# EAGLE schematic CntrlBoardV3B (EAGLE 8.3.2)

## Sheet 1 of 8: µC, MRAM, I2C Memory, and Peripherals
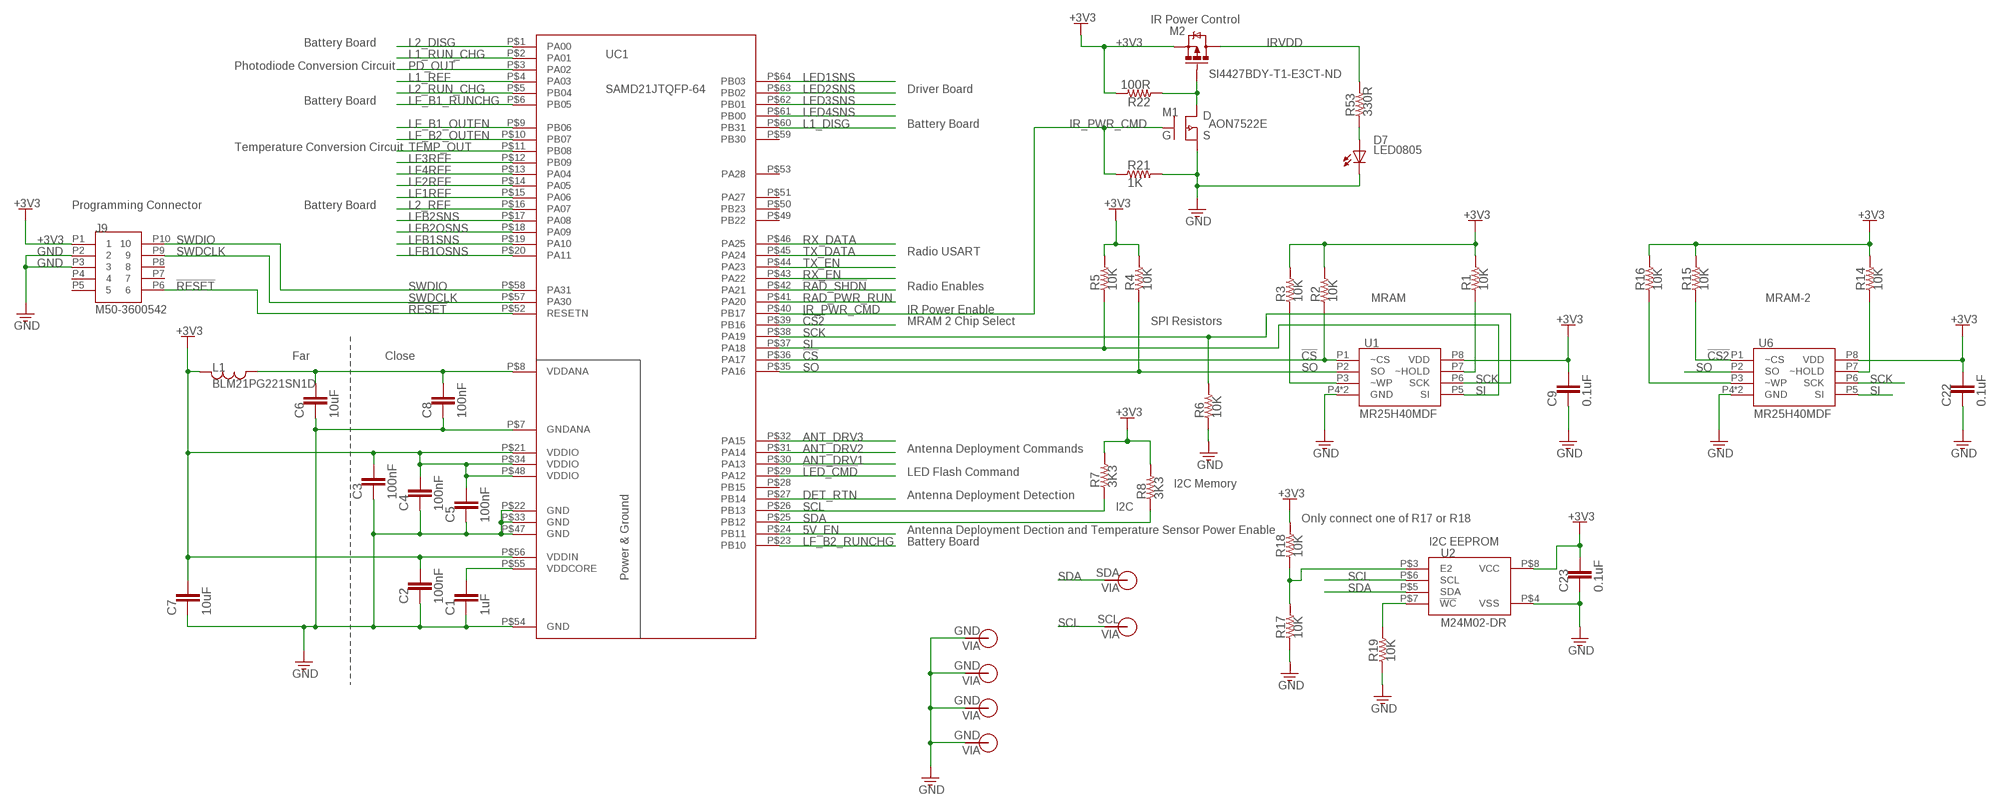
[diagram p0: schematic, sheet 1]

### Parts
C1  1uF  CAP0805  [0805]
C2  100nF  CAP0805  [0805]
C3  100nF  CAP0805  [0805]
C4  100nF  CAP0805  [0805]
C5  100nF  CAP0805  [0805]
C6  10uF  CAP0805  [0805]
C7  10uF  CAP0805  [0805]
C8  100nF  CAP0805  [0805]
C9  0.1uF  CAP0805  [0805]
C22  0.1uF  CAP0805  [0805]
C23  0.1uF  CAP0805  [0805]
D7  LED0805  [0805-D]
J9  M50-3600542  10PINMALE  [10PINMALE]
L1  BLM21PG221SN1D  FERRITE  [0805]
M1  AON7522E  [DFN-3X3-8]
M2  SI4427BDY-T1-E3CT-ND  POWERPMOS  [SO08]
R1  10K  RES0805  [0805]
R2  10K  RES0805  [0805]
R3  10K  RES0805  [0805]
R4  10K  RES0805  [0805]
R5  10K  RES0805  [0805]
R6  10K  RES0805  [0805]
R7  3K3  RES0805  [0805]
R8  3K3  RES0805  [0805]
R14  10K  RES0805  [0805]
R15  10K  RES0805  [0805]
R16  10K  RES0805  [0805]
R17  10K  RES0805  [0805]
R18  10K  RES0805  [0805]
R19  10K  RES0805  [0805]
R21  1K  RES0805  [0805]
R22  100R  RES0805  [0805]
R53  330R  RES0805  [0805]
U1  MR25H40MDF  MR2XHXX  [8PXMO-229]
U2  M24M02-DR  [SO-8]
U6  MR25H40MDF  MR2XHXX  [8PXMO-229]
UC1  SAMD21JTQFP-64  [TQFP-64]
V4  SDA  VIA60MIL-SQ  [VIA-60MIL-SQ]
V5  SCL  VIA60MIL-SQ  [VIA-60MIL-SQ]
V9  GND  VIA60MIL-SQ  [VIA-60MIL-SQ]
V10  GND  VIA60MIL-SQ  [VIA-60MIL-SQ]
V11  GND  VIA60MIL-SQ  [VIA-60MIL-SQ]
V12  GND  VIA60MIL-SQ  [VIA-60MIL-SQ]

### Nets
5V_EN: UC1.P$24(PB11) ; also sheet 2
!CS2!: R15.1 U6.P1(~CS) UC1.P$39(PB16)
!CS!: R2.1 U1.P1(~CS) UC1.P$36(PA17)
!LED_CMD!: UC1.P$29(PA12) ; also sheet 7
!RAD_SHDN!: UC1.P$42(PA21) ; also sheet 3
!RESET!: J9.P6 UC1.P$52(RESETN) ; also sheet 6
+3V3: C2.1 C3.1 C4.1 C5.1 C7.1 C9.1 C22.1 C23.1 J9.P1 L1.1 M2.1(S) M2.2(S) M2.3(S) R1.2 R2.2 R3.2 R4.2 R5.2 R7.2 R8.2 R14.2 R15.2 R16.2 R18.2 R22.2 U1.P8(VDD) U2.P$8(VCC) U6.P8(VDD) UC1.P$21(VDDIO) UC1.P$34(VDDIO) UC1.P$48(VDDIO) UC1.P$56(VDDIN) ; also sheet 2,3,4,5,6,7,8
ANT_DRV1: UC1.P$30(PA13) ; also sheet 7
ANT_DRV2: UC1.P$31(PA14) ; also sheet 7
ANT_DRV3: UC1.P$32(PA15) ; also sheet 7
DET_RTN: UC1.P$27(PB14) ; also sheet 7
GND: C1.2 C2.2 C3.2 C4.2 C5.2 C6.2 C7.2 C8.2 C9.2 C22.2 C23.2 D7.C J9.P2 J9.P3 M1.P$1(S) M1.P$2(S) M1.P$3(S) R6.1 R17.1 R19.1 R21.2 U1.P4(GND) U1.P9(GND) U2.P$4(VSS) U6.P4(GND) U6.P9(GND) UC1.P$7(GNDANA) UC1.P$22(GND) UC1.P$33(GND) UC1.P$47(GND) UC1.P$54(GND) V9.P$1 V10.P$1 V11.P$1 V12.P$1 ; also sheet 2,3,4,5,6,7,8
IR_PWR_CMD: M1.P$4(G) R21.1 UC1.P$40(PB17)
IRVDD: M2.5(D) M2.6(D) M2.7(D) M2.8(D) R53.2 ; also sheet 6,7
L1_DISG: UC1.P$60(PB31) ; also sheet 5
L1_REF: UC1.P$4(PA03) ; also sheet 5
L1_RUN_CHG: UC1.P$2(PA01) ; also sheet 5
L2_DISG: UC1.P$1(PA00) ; also sheet 5
L2_REF: UC1.P$16(PA07) ; also sheet 5
L2_RUN_CHG: UC1.P$5(PB04) ; also sheet 5
LED1SNS: UC1.P$64(PB03) ; also sheet 7
LED2SNS: UC1.P$63(PB02) ; also sheet 7
LED3SNS: UC1.P$62(PB01) ; also sheet 7
LED4SNS: UC1.P$61(PB00) ; also sheet 7
LF1REF: UC1.P$15(PA06) ; also sheet 5
LF2REF: UC1.P$14(PA05) ; also sheet 5
LF3REF: UC1.P$12(PB09) ; also sheet 5
LF4REF: UC1.P$13(PA04) ; also sheet 5
LF_B1_OUTEN: UC1.P$9(PB06) ; also sheet 5
LF_B1_RUNCHG: UC1.P$6(PB05) ; also sheet 5
LF_B2_OUTEN: UC1.P$10(PB07) ; also sheet 5
LF_B2_RUNCHG: UC1.P$23(PB10) ; also sheet 5
LFB1OSNS: UC1.P$20(PA11) ; also sheet 5
LFB1SNS: UC1.P$19(PA10) ; also sheet 5
LFB2OSNS: UC1.P$18(PA09) ; also sheet 5
LFB2SNS: UC1.P$17(PA08) ; also sheet 5
N$1: C6.1 C8.1 L1.2 UC1.P$8(VDDANA)
N$2: C1.1 UC1.P$55(VDDCORE)
N$3: R3.1 U1.P3(~WP)
N$4: R1.1 U1.P7(~HOLD)
N$12: R16.1 U6.P3(~WP)
N$16: R14.1 U6.P7(~HOLD)
N$17: R17.2 R18.1 U2.P$3(E2)
N$18: R19.2 U2.P$7(!WC!)
N$22: M1.P$5(D) M1.P$6(D) M1.P$7(D) M1.P$8(D) M1.PAD(D) M2.4(G) R22.1
N$29: D7.A R53.1
PD_OUT: UC1.P$3(PA02) ; also sheet 8
RAD_PWR_RUN: UC1.P$41(PA20) ; also sheet 3
RX_DATA: UC1.P$46(PA25) ; also sheet 3
RX_EN: UC1.P$43(PA22) ; also sheet 3
SCK: R6.2 U1.P6(SCK) U6.P6(SCK) UC1.P$38(PA19)
SCL: R7.1 U2.P$6(SCL) UC1.P$26(PB13) V5.P$1 ; also sheet 4,5,6,7,8
SDA: R8.1 U2.P$5(SDA) UC1.P$25(PB12) V4.P$1 ; also sheet 4,5,6,7,8
SI: R5.1 U1.P5(SI) U6.P5(SI) UC1.P$37(PA18)
SO: R4.1 U1.P2(SO) U6.P2(SO) UC1.P$35(PA16)
SWDCLK: J9.P9 UC1.P$57(PA30) ; also sheet 6
SWDIO: J9.P10 UC1.P$58(PA31) ; also sheet 6
TEMP_OUT: UC1.P$11(PB08) ; also sheet 8
TX_DATA: UC1.P$45(PA24) ; also sheet 3
TX_EN: UC1.P$44(PA23) ; also sheet 3
Unconnected: J9.P4 J9.P5 J9.P7 J9.P8 UC1.P$28(PB15) UC1.P$49(PB22) UC1.P$50(PB23) UC1.P$51(PA27) UC1.P$53(PA28) UC1.P$59(PB30)

### Notes on the sheet
- IR Power Control
- Battery Board
- Photodiode Conversion Circuit
- Driver Board
- Battery Board
- Battery Board
- Temperature Conversion Circuit
- Programming Connector | Battery Board
- Radio USART
- Radio Enables
- MRAM | MRAM-2
- IR Power Enable
- MRAM 2 Chip Select | SPI Resistors
- Far | Close
- Antenna Deployment Commands
- LED Flash Command
- I2C Memory
- Antenna Deployment Detection
- I2C
- Only connect one of R17 or R18
- Antenna Deployment Dection and Temperature Sensor Power Enable
- Battery Board | I2C EEPROM

## Sheet 2 of 8: Power Regulation
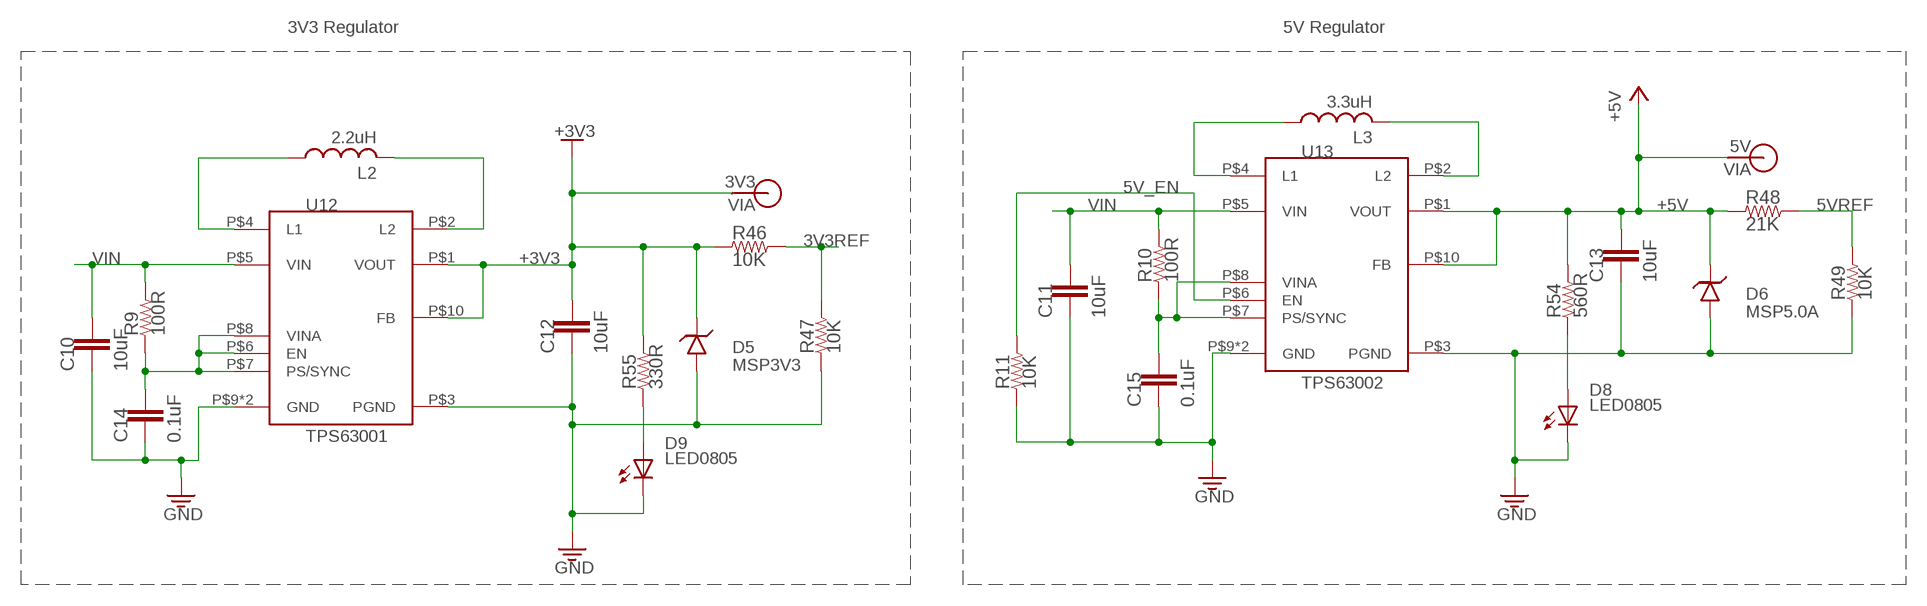
[diagram p1: schematic, sheet 2]

### Parts
C10  10uF  CAP0805  [0805]
C11  10uF  CAP0805  [0805]
C12  10uF  CAP0805  [0805]
C13  10uF  CAP0805  [0805]
C14  0.1uF  CAP0805  [0805]
C15  0.1uF  CAP0805  [0805]
D5  MSP3V3  TVSMSP  [MICROSMP]
D6  MSP5.0A  TVSMSP  [MICROSMP]
D8  LED0805  [0805-D]
D9  LED0805  [0805-D]
L2  2.2uH  L-USL3225M  [L3225M]
L3  3.3uH  L-USL3225M  [L3225M]
R9  100R  RES0805  [0805]
R10  100R  RES0805  [0805]
R11  10K  RES0805  [0805]
R46  10K  RES0805  [0805]
R47  10K  RES0805  [0805]
R48  21K  RES0805  [0805]
R49  10K  RES0805  [0805]
R54  560R  RES0805  [0805]
R55  330R  RES0805  [0805]
U12  TPS63001  TPS6300X  [QFN10_POWERPAD]
U13  TPS63002  TPS6300X  [QFN10_POWERPAD]
V13  3V3  VIA60MIL-SQ  [VIA-60MIL-SQ]
V14  5V  VIA60MIL-SQ  [VIA-60MIL-SQ]

### Nets
3V3REF: R46.2 R47.2 ; also sheet 8
5V_EN: R11.2 U13.P$6(EN) ; also sheet 1
5VREF: R48.2 R49.2 ; also sheet 8
+3V3: C12.1 D5.C R46.1 R55.2 U12.P$1(VOUT) U12.P$10(FB) V13.P$1 ; also sheet 1,3,4,5,6,7,8
+5V: C13.1 D6.C R48.1 R54.2 U13.P$1(VOUT) U13.P$10(FB) V14.P$1 ; also sheet 5,7
GND: C10.2 C11.2 C12.2 C13.2 C14.2 C15.2 D5.A D6.A D8.C D9.C R11.1 R47.1 R49.1 U12.P$3(PGND) U12.P$9(GND) U12.PAD(GND) U13.P$3(PGND) U13.P$9(GND) U13.PAD(GND) ; also sheet 1,3,4,5,6,7,8
N$5: L2.1 U12.P$4(L1)
N$6: L2.2 U12.P$2(L2)
N$7: L3.1 U13.P$4(L1)
N$8: L3.2 U13.P$2(L2)
N$9: C14.1 R9.1 U12.P$6(EN) U12.P$7(PS/SYNC) U12.P$8(VINA)
N$10: C15.1 R10.1 U13.P$7(PS/SYNC) U13.P$8(VINA)
N$30: D8.A R54.1
N$31: D9.A R55.1
VIN: C10.1 C11.1 R9.2 R10.2 U12.P$5(VIN) U13.P$5(VIN) ; also sheet 3,6

### Notes on the sheet
- 3V3 Regulator | 5V Regulator

## Sheet 3 of 8: Radio
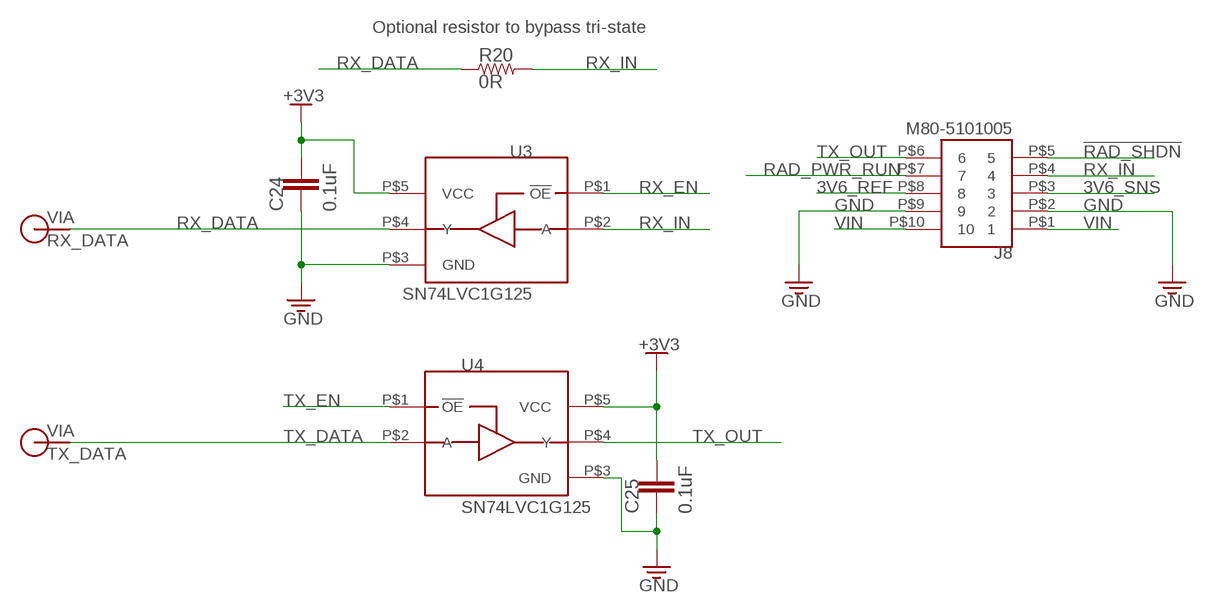
[diagram p2: schematic, sheet 3]

### Parts
C24  0.1uF  CAP0805  [0805]
C25  0.1uF  CAP0805  [0805]
J8  M80-5101005  [M80-510]
R20  0R  RES0805  [0805]
U3  SN74LVC1G125  [TSOT23-5]
U4  SN74LVC1G125  [TSOT23-5]
V1  RX_DATA  VIA60MIL-SQ  [VIA-60MIL-SQ]
V2  TX_DATA  VIA60MIL-SQ  [VIA-60MIL-SQ]

### Nets
3V6_REF: J8.P$8 ; also sheet 8
3V6_SNS: J8.P$3 ; also sheet 8
!RAD_SHDN!: J8.P$5 ; also sheet 1
+3V3: C24.1 C25.1 U3.P$5(VCC) U4.P$5(VCC) ; also sheet 1,2,4,5,6,7,8
GND: C24.2 C25.2 J8.P$2 J8.P$9 U3.P$3(GND) U4.P$3(GND) ; also sheet 1,2,4,5,6,7,8
RAD_PWR_RUN: J8.P$7 ; also sheet 1
RX_DATA: R20.1 U3.P$4(Y) V1.P$1 ; also sheet 1
RX_EN: U3.P$1(!OE!) ; also sheet 1
RX_IN: J8.P$4 R20.2 U3.P$2(A)
TX_DATA: U4.P$2(A) V2.P$1 ; also sheet 1
TX_EN: U4.P$1(!OE!) ; also sheet 1
TX_OUT: J8.P$6 U4.P$4(Y)
VIN: J8.P$1 J8.P$10 ; also sheet 2,6

### Notes on the sheet
- Optional resistor to bypass tri-state

## Sheet 4 of 8: Control Board Sensors
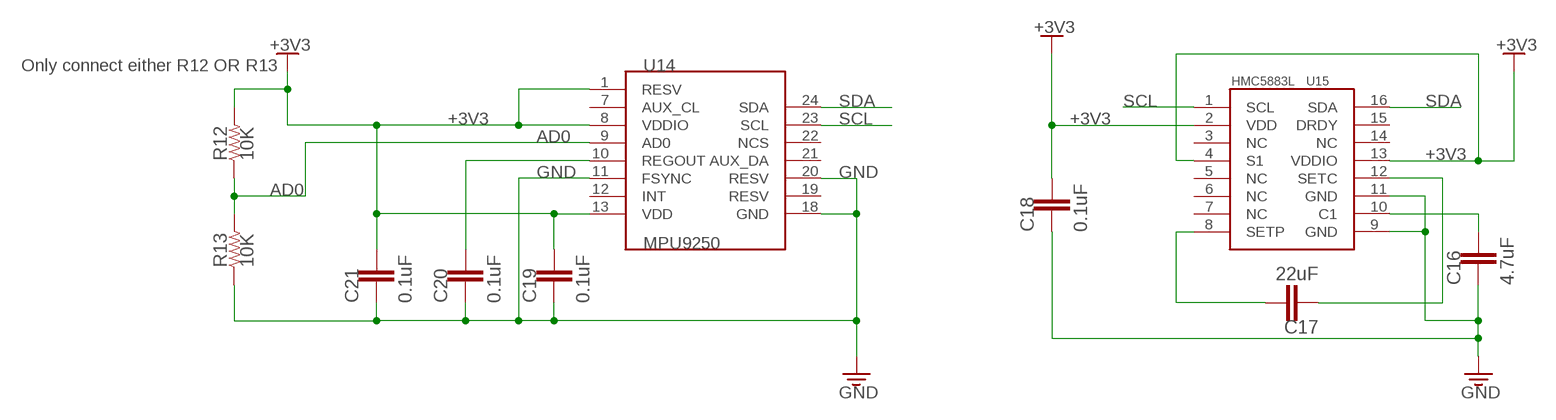
[diagram p3: schematic, sheet 4]

### Parts
C16  4.7uF  CAP0805  [0805]
C17  22uF  CAP0805  [0805]
C18  0.1uF  CAP0805  [0805]
C19  0.1uF  CAP0805  [0805]
C20  0.1uF  CAP0805  [0805]
C21  0.1uF  CAP0805  [0805]
R12  10K  RES0805  [0805]
R13  10K  RES0805  [0805]
U14  MPU9250  [QFN-24-3X3]
U15  HMC5883L  [HMC5883L]

### Nets
+3V3: C18.1 C19.1 C21.1 R12.2 U14.1(RESV) U14.8(VDDIO) U14.13(VDD) U15.2(VDD) U15.4(S1) U15.13(VDDIO) ; also sheet 1,2,3,5,6,7,8
AD0: R12.1 R13.2 U14.9(AD0)
GND: C16.2 C18.2 C19.2 C20.2 C21.2 R13.1 U14.11(FSYNC) U14.18(GND) U14.20(RESV) U15.9(GND) U15.11(GND) ; also sheet 1,2,3,5,6,7,8
N$11: C16.1 U15.10(C1)
N$13: C20.1 U14.10(REGOUT)
N$14: C17.2 U15.12(SETC)
N$15: C17.1 U15.8(SETP)
SCL: U14.23(SCL) U15.1(SCL) ; also sheet 1,5,6,7,8
SDA: U14.24(SDA) U15.16(SDA) ; also sheet 1,5,6,7,8
Unconnected: U14.7(AUX_CL) U14.12(INT) U14.19(RESV) U14.21(AUX_DA) U14.22(NCS) U15.3(NC) U15.5(NC) U15.6(NC) U15.7(NC) U15.14(NC) U15.15(DRDY)

### Notes on the sheet
- Only connect either R12 OR R13

## Sheet 5 of 8: Battery Board
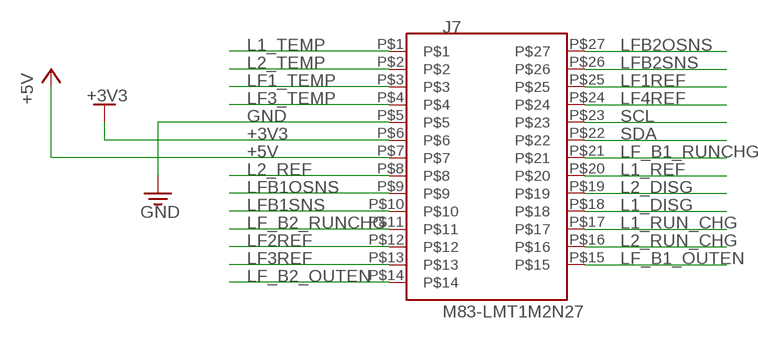
[diagram p4: schematic, sheet 5]

### Parts
J7  M83-LMT1M2N27  [M83-LMT1M2N27]

### Nets
+3V3: J7.P$6 ; also sheet 1,2,3,4,6,7,8
+5V: J7.P$7 ; also sheet 2,7
GND: J7.P$5 ; also sheet 1,2,3,4,6,7,8
L1_DISG: J7.P$18 ; also sheet 1
L1_REF: J7.P$20 ; also sheet 1
L1_RUN_CHG: J7.P$17 ; also sheet 1
L1_TEMP: J7.P$1 ; also sheet 8
L2_DISG: J7.P$19 ; also sheet 1
L2_REF: J7.P$8 ; also sheet 1
L2_RUN_CHG: J7.P$16 ; also sheet 1
L2_TEMP: J7.P$2 ; also sheet 8
LF1_TEMP: J7.P$3 ; also sheet 8
LF1REF: J7.P$25 ; also sheet 1
LF2REF: J7.P$12 ; also sheet 1
LF3_TEMP: J7.P$4 ; also sheet 8
LF3REF: J7.P$13 ; also sheet 1
LF4REF: J7.P$24 ; also sheet 1
LF_B1_OUTEN: J7.P$15 ; also sheet 1
LF_B1_RUNCHG: J7.P$21 ; also sheet 1
LF_B2_OUTEN: J7.P$14 ; also sheet 1
LF_B2_RUNCHG: J7.P$11 ; also sheet 1
LFB1OSNS: J7.P$9 ; also sheet 1
LFB1SNS: J7.P$10 ; also sheet 1
LFB2OSNS: J7.P$27 ; also sheet 1
LFB2SNS: J7.P$26 ; also sheet 1
SCL: J7.P$23 ; also sheet 1,4,6,7,8
SDA: J7.P$22 ; also sheet 1,4,6,7,8

## Sheet 6 of 8: Solar Panels
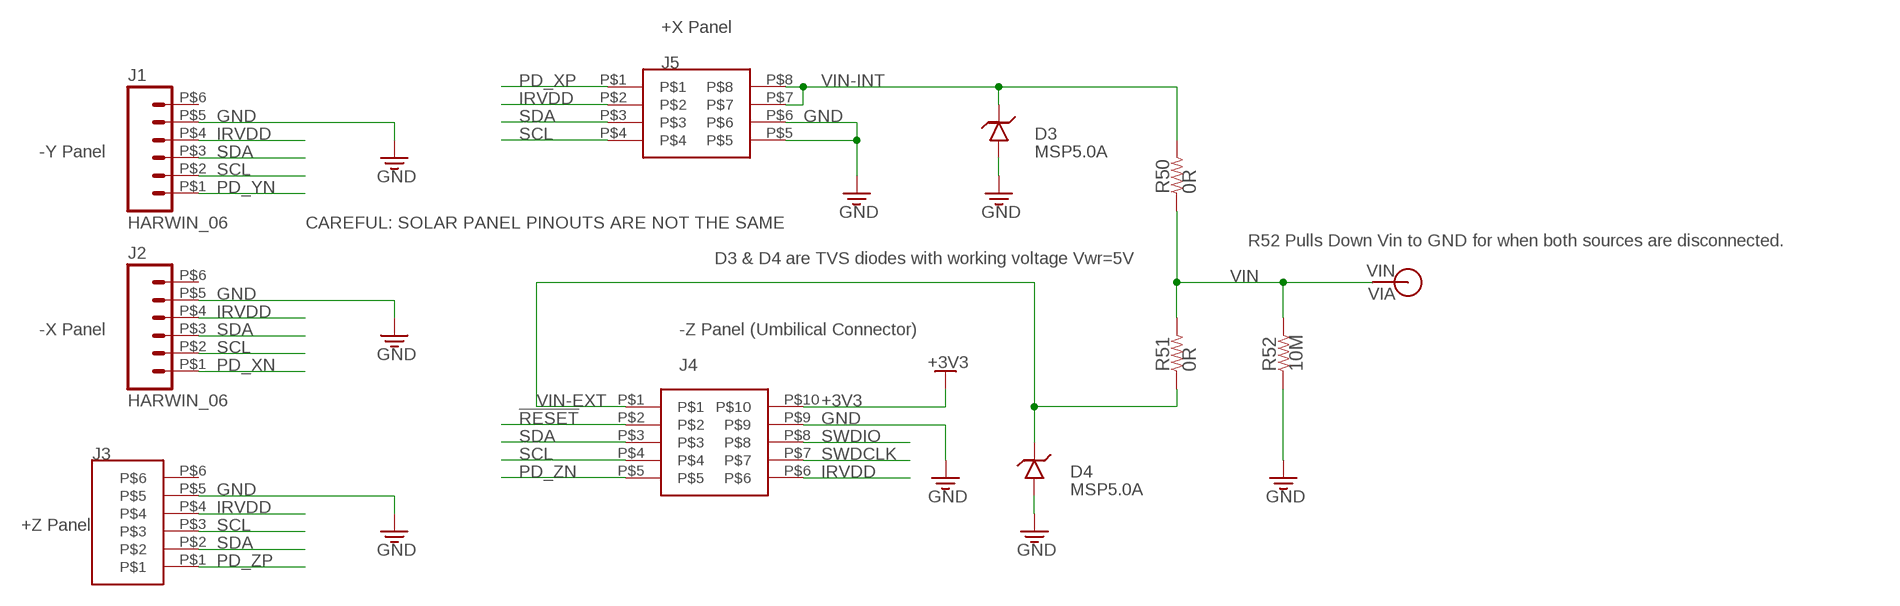
[diagram p5: schematic, sheet 6]

### Parts
D3  MSP5.0A  TVSMSP  [MICROSMP]
D4  MSP5.0A  TVSMSP  [MICROSMP]
J1  HARWIN_06  [HARWIN_DATAMATE_6]
J2  HARWIN_06  [HARWIN_DATAMATE_6]
J3  M80-54006  [M80-54006]
J4  M80-54010  [M80-54010]
J5  M80-54008  [M80-54008]
R50  0R  RES1210  [1210]
R51  0R  RES1210  [1210]
R52  10M  RES0805  [0805]
V3  VIN  VIA60MIL-SQ  [VIA-60MIL-SQ]

### Nets
!RESET!: J4.P$2 ; also sheet 1
+3V3: J4.P$10 ; also sheet 1,2,3,4,5,7,8
GND: D3.A D4.A J1.P$5 J2.P$5 J3.P$5 J4.P$9 J5.P$5 J5.P$6 R52.1 ; also sheet 1,2,3,4,5,7,8
IRVDD: J1.P$4 J2.P$4 J3.P$4 J4.P$6 J5.P$2 ; also sheet 1,7
PD_XN: J2.P$1 ; also sheet 8
PD_XP: J5.P$1 ; also sheet 8
PD_YN: J1.P$1 ; also sheet 8
PD_ZN: J4.P$5 ; also sheet 8
PD_ZP: J3.P$1 ; also sheet 8
SCL: J1.P$2 J2.P$2 J3.P$3 J4.P$4 J5.P$4 ; also sheet 1,4,5,7,8
SDA: J1.P$3 J2.P$3 J3.P$2 J4.P$3 J5.P$3 ; also sheet 1,4,5,7,8
SWDCLK: J4.P$7 ; also sheet 1
SWDIO: J4.P$8 ; also sheet 1
VIN: R50.P$1 R51.P$2 R52.2 V3.P$1 ; also sheet 2,3
VIN-EXT: D4.C J4.P$1 R51.P$1
VIN-INT: D3.C J5.P$7 J5.P$8 R50.P$2
Unconnected: J1.P$6 J2.P$6 J3.P$6

### Notes on the sheet
- +X Panel
- -Y Panel
- CAREFUL: SOLAR PANEL PINOUTS ARE NOT THE SAME
- R52 Pulls Down Vin to GND for when both sources are disconnected.
- D3 & D4 are TVS diodes with working voltage Vwr=5V
- -X Panel | -Z Panel (Umbilical Connector)
- +Z Panel

## Sheet 7 of 8: Driver Board
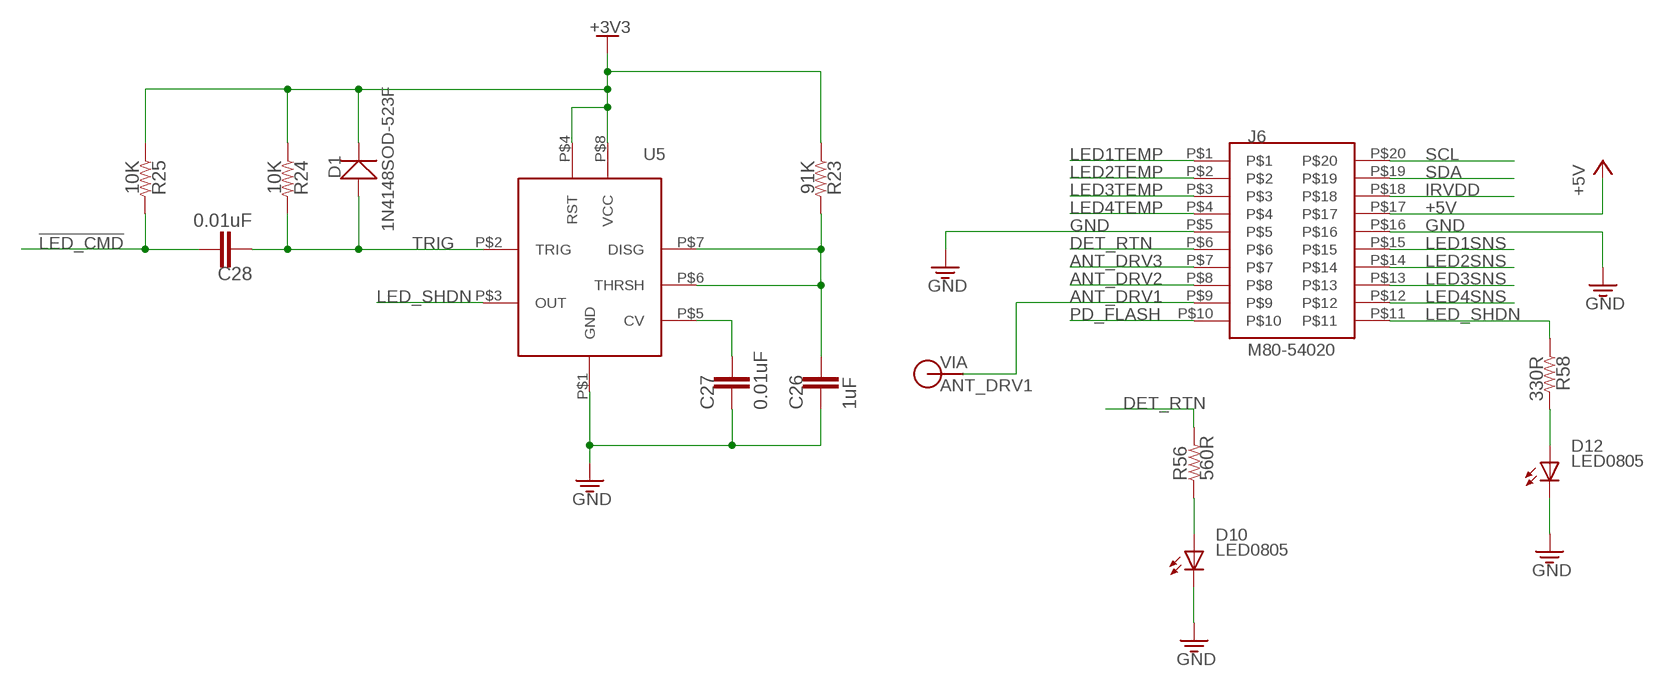
[diagram p6: schematic, sheet 7]

### Parts
C26  1uF  CAP0805  [0805]
C27  0.01uF  CAP0805  [0805]
C28  0.01uF  CAP0805  [0805]
D1  1N4148SOD-523F  1N4148SOD-523FSMD  [SOD-523F]
D10  LED0805  [0805-D]
D12  LED0805  [0805-D]
J6  M80-54020  [M80-54020]
R23  91K  RES0805  [0805]
R24  10K  RES0805  [0805]
R25  10K  RES0805  [0805]
R56  560R  RES0805  [0805]
R58  330R  RES0805  [0805]
U5  TLC555  [SO-8]
V6  ANT_DRV1  VIA60MIL-SQ  [VIA-60MIL-SQ]

### Nets
!LED_CMD!: C28.1 R25.2 ; also sheet 1
+3V3: D1.C R23.1 R24.1 R25.1 U5.P$4(RST) U5.P$8(VCC) ; also sheet 1,2,3,4,5,6,8
+5V: J6.P$17 ; also sheet 2,5
ANT_DRV1: J6.P$9 V6.P$1 ; also sheet 1
ANT_DRV2: J6.P$8 ; also sheet 1
ANT_DRV3: J6.P$7 ; also sheet 1
DET_RTN: J6.P$6 R56.2 ; also sheet 1
GND: C26.2 C27.2 D10.C D12.C J6.P$5 J6.P$16 U5.P$1(GND) ; also sheet 1,2,3,4,5,6,8
IRVDD: J6.P$18 ; also sheet 1,6
LED1SNS: J6.P$15 ; also sheet 1
LED1TEMP: J6.P$1 ; also sheet 8
LED2SNS: J6.P$14 ; also sheet 1
LED2TEMP: J6.P$2 ; also sheet 8
LED3SNS: J6.P$13 ; also sheet 1
LED3TEMP: J6.P$3 ; also sheet 8
LED4SNS: J6.P$12 ; also sheet 1
LED4TEMP: J6.P$4 ; also sheet 8
LED_SHDN: J6.P$11 R58.1 U5.P$3(OUT)
N$20: C26.1 R23.2 U5.P$6(THRSH) U5.P$7(DISG)
N$23: C27.1 U5.P$5(CV)
N$40: D10.A R56.1
N$44: D12.A R58.2
PD_FLASH: J6.P$10 ; also sheet 8
SCL: J6.P$20 ; also sheet 1,4,5,6,8
SDA: J6.P$19 ; also sheet 1,4,5,6,8
TRIG: C28.2 D1.A R24.2 U5.P$2(TRIG)

## Sheet 8 of 8: Multiplexing, Conversion, and Remote ADC
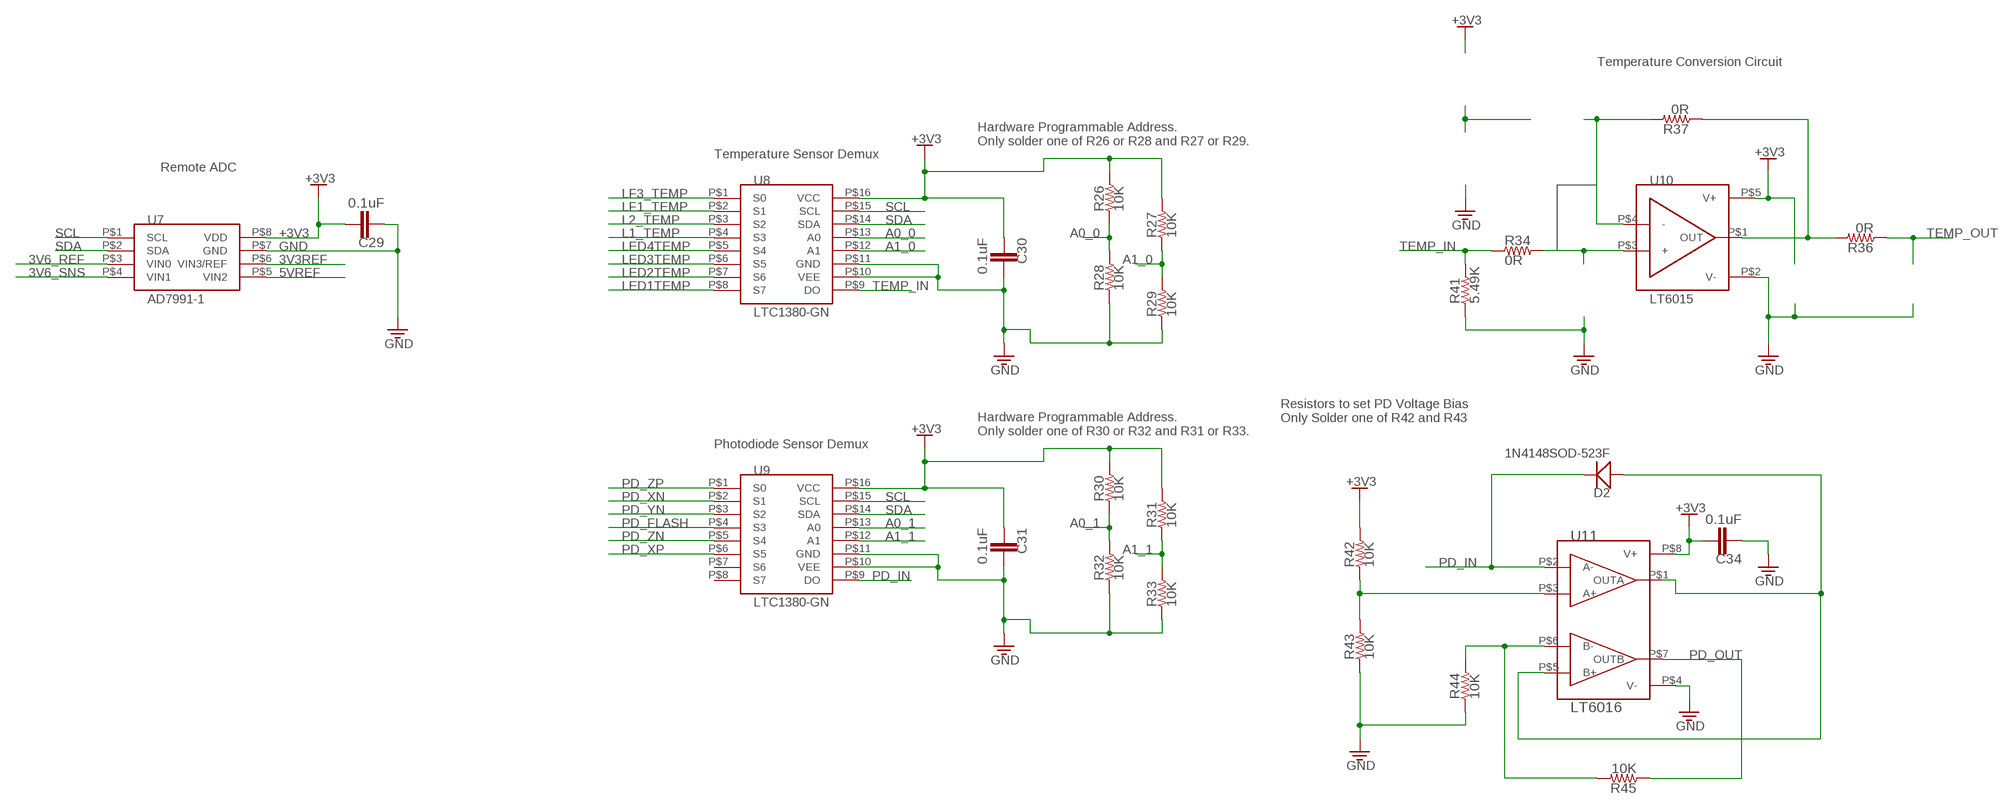
[diagram p7: schematic, sheet 8]

### Parts
C29  0.1uF  CAP0805  [0805]
C30  0.1uF  CAP0805  [0805]
C31  0.1uF  CAP0805  [0805]
C34  0.1uF  CAP0805  [0805]
D2  1N4148SOD-523F  1N4148SOD-523FSMD  [SOD-523F]
R26  10K  RES0805  [0805]
R27  10K  RES0805  [0805]
R28  10K  RES0805  [0805]
R29  10K  RES0805  [0805]
R30  10K  RES0805  [0805]
R31  10K  RES0805  [0805]
R32  10K  RES0805  [0805]
R33  10K  RES0805  [0805]
R34  0R  RES0805  [0805]
R36  0R  RES0805  [0805]
R37  0R  RES0805  [0805]
R41  5.49K  RES0805  [0805]
R42  10K  RES0805  [0805]
R43  10K  RES0805  [0805]
R44  10K  RES0805  [0805]
R45  10K  RES0805  [0805]
U7  AD7991-1  [SOT-23-8]
U8  LTC1380-GN  [SSOP-16-NARROW]
U9  LTC1380-GN  [SSOP-16-NARROW]
U10  LT6015  [TSOT23-5]
U11  LT6016  [MSOP-8]

### Nets
3V3REF: U7.P$6(VIN3/REF) ; also sheet 2
3V6_REF: U7.P$3(VIN0) ; also sheet 3
3V6_SNS: U7.P$4(VIN1) ; also sheet 3
5VREF: U7.P$5(VIN2) ; also sheet 2
+3V3: C29.1 C30.2 C31.2 C34.1 R26.2 R27.2 R30.2 R31.2 R42.2 U7.P$8(VDD) U8.P$16(VCC) U9.P$16(VCC) U10.P$5(V+) U11.P$8(V+) ; also sheet 1,2,3,4,5,6,7
A0_0: R26.1 R28.2 U8.P$13(A0)
A0_1: R30.1 R32.2 U9.P$13(A0)
A1_0: R27.1 R29.2 U8.P$12(A1)
A1_1: R31.1 R33.2 U9.P$12(A1)
GND: C29.2 C30.1 C31.1 C34.2 R28.1 R29.1 R32.1 R33.1 R41.1 R43.1 R44.1 U7.P$7(GND) U8.P$10(VEE) U8.P$11(GND) U9.P$10(VEE) U9.P$11(GND) U10.P$2(V-) U11.P$4(V-) ; also sheet 1,2,3,4,5,6,7
L1_TEMP: U8.P$4(S3) ; also sheet 5
L2_TEMP: U8.P$3(S2) ; also sheet 5
LED1TEMP: U8.P$8(S7) ; also sheet 7
LED2TEMP: U8.P$7(S6) ; also sheet 7
LED3TEMP: U8.P$6(S5) ; also sheet 7
LED4TEMP: U8.P$5(S4) ; also sheet 7
LF1_TEMP: U8.P$2(S1) ; also sheet 5
LF3_TEMP: U8.P$1(S0) ; also sheet 5
N$19: R34.2 U10.P$3(+)
N$25: R37.2 U10.P$4(-)
N$27: R36.2 R37.1 U10.P$1(OUT)
N$33: D2.A U11.P$1(OUTA) U11.P$5(B+)
N$34: R42.1 R43.2 U11.P$3(A+)
N$38: R44.2 R45.2 U11.P$6(B-)
PD_FLASH: U9.P$4(S3) ; also sheet 7
PD_IN: D2.C U9.P$9(DO) U11.P$2(A-)
PD_OUT: R45.1 U11.P$7(OUTB) ; also sheet 1
PD_XN: U9.P$2(S1) ; also sheet 6
PD_XP: U9.P$6(S5) ; also sheet 6
PD_YN: U9.P$3(S2) ; also sheet 6
PD_ZN: U9.P$5(S4) ; also sheet 6
PD_ZP: U9.P$1(S0) ; also sheet 6
SCL: U7.P$1(SCL) U8.P$15(SCL) U9.P$15(SCL) ; also sheet 1,4,5,6,7
SDA: U7.P$2(SDA) U8.P$14(SDA) U9.P$14(SDA) ; also sheet 1,4,5,6,7
TEMP_IN: R34.1 R41.2 U8.P$9(DO)
TEMP_OUT: R36.1 ; also sheet 1
Unconnected: U9.P$7(S6) U9.P$8(S7)

### Notes on the sheet
- Temperature Conversion Circuit
- Hardware Programmable Address.
  Only solder one of R26 or R28 and R27 or R29.
- Temperature Sensor Demux
- Remote ADC
- Resistors to set PD Voltage Bias
  Only Solder one of R42 and R43
- Hardware Programmable Address.
  Only solder one of R30 or R32 and R31 or R33.
- Photodiode Sensor Demux

## Library data of the parts
C1-C31 C34 = BrownSpaceEngineering:CAP: Capacitor
D1 D2 = BrownSpaceEngineering:1N4148
D3-D6 = BrownSpaceEngineering:TVS
D7-D10 D12 = BrownSpaceEngineering:LED
J1 J2 = CNTRL_BOARD:HARWIN_06
J3 = BrownSpaceEngineering:M80-54006
J4 = BrownSpaceEngineering:M80-54010
J5 = BrownSpaceEngineering:M80-54008
J6 = BrownSpaceEngineering:M80-54020
J7 = BrownSpaceEngineering:M83-LMT1M2N27
J8 = BrownSpaceEngineering:M80-5101005
J9 = BrownSpaceEngineering:10PINMALE
L1 = BrownSpaceEngineering:FERRITE
L2 L3 = resistor:L-US: INDUCTOR, American symbol
M1 = BrownSpaceEngineering:AON7522E
M2 = CNTRL_BOARD:POWERPMOS
R1-R34 R36 R37 R41-R56 R58 = BrownSpaceEngineering:RES
U1 U6 = BrownSpaceEngineering:MR2XHXX
U2 = BrownSpaceEngineering:M24M02-DR
U3 U4 = BrownSpaceEngineering:SN74LVC1G125
U5 = BrownSpaceEngineering:TLC555
U7 = BrownSpaceEngineering:AD7991
U8 U9 = BrownSpaceEngineering:LTC1380
U10 = BrownSpaceEngineering:LT6015
U11 = BrownSpaceEngineering:LT6016
U12 U13 = CNTRL_BOARD:TPS6300X
U14 = CNTRL_BOARD:MPU9250
U15 = CNTRL_BOARD:HMC5883L
UC1 = BrownSpaceEngineering:SAMD21J
V1-V6 V9-V14 = BrownSpaceEngineering:VIA